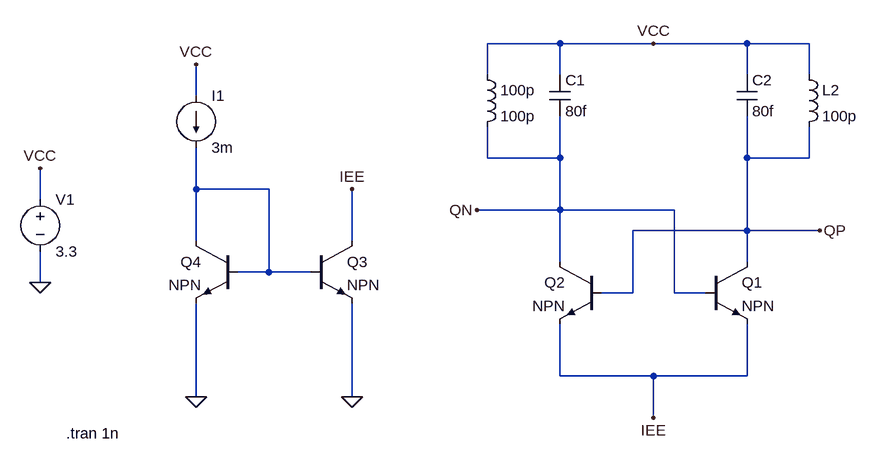
[diagram p0: schematic vco.asc]
vco.asc, the LTspice schematic file:
Version 4
SHEET 1 880 872
WIRE 240 -32 128 -32
WIRE 384 -32 240 -32
WIRE 528 -32 384 -32
WIRE 624 -32 528 -32
WIRE 128 16 128 -32
WIRE 240 16 240 -32
WIRE 528 16 528 -32
WIRE 624 16 624 -32
WIRE -320 48 -320 0
WIRE 128 144 128 96
WIRE 240 144 240 80
WIRE 240 144 128 144
WIRE 528 144 528 80
WIRE 624 144 624 96
WIRE 624 144 528 144
WIRE -320 192 -320 128
WIRE -208 192 -320 192
WIRE -560 208 -560 160
WIRE 240 224 240 144
WIRE 240 224 112 224
WIRE 416 224 240 224
WIRE 528 256 528 144
WIRE 528 256 352 256
WIRE 640 256 528 256
WIRE -320 272 -320 192
WIRE -80 272 -80 192
WIRE 240 304 240 224
WIRE 528 304 528 256
WIRE -208 320 -208 192
WIRE -208 320 -256 320
WIRE -144 320 -208 320
WIRE -560 336 -560 288
WIRE 352 352 352 256
WIRE 352 352 304 352
WIRE 416 352 416 224
WIRE 464 352 416 352
WIRE 240 480 240 400
WIRE 384 480 240 480
WIRE 528 480 528 400
WIRE 528 480 384 480
WIRE -320 512 -320 368
WIRE -80 512 -80 368
WIRE 384 544 384 480
FLAG -320 512 0
FLAG -80 512 0
FLAG 112 224 QN
FLAG 640 256 QP
FLAG -560 336 0
FLAG -560 160 VCC
FLAG -320 0 VCC
FLAG 384 -32 VCC
FLAG -80 192 IEE
FLAG 384 544 IEE
SYMBOL ind 112 0 R0
SYMATTR InstName 100p
SYMATTR Value 100p
SYMBOL ind 608 0 R0
SYMATTR InstName L2
SYMATTR Value 100p
SYMBOL cap 224 16 R0
SYMATTR InstName C1
SYMATTR Value 80f
SYMBOL cap 512 16 R0
SYMATTR InstName C2
SYMATTR Value 80f
SYMBOL npn 464 304 R0
SYMATTR InstName Q1
SYMBOL npn 304 304 M0
SYMATTR InstName Q2
SYMBOL npn -144 272 R0
SYMATTR InstName Q3
SYMBOL npn -256 272 M0
SYMATTR InstName Q4
SYMBOL voltage -560 192 R0
WINDOW 123 0 0 Left 0
WINDOW 39 0 0 Left 0
SYMATTR InstName V1
SYMATTR Value 3.3
SYMBOL current -320 48 R0
WINDOW 123 0 0 Left 0
WINDOW 39 0 0 Left 0
SYMATTR InstName I1
SYMATTR Value 3m
TEXT -520 568 Left 2 !.tran 1n

The netlist it stands for:
* vco.asc
L§100p VCC QN 100p
L2 VCC QP 100p
C1 VCC QN 80f
C2 VCC QP 80f
Q1 QP QN IEE 0 NPN
Q2 QN QP IEE 0 NPN
Q3 IEE N001 0 0 NPN
Q4 N001 N001 0 0 NPN
V1 VCC 0 3.3
I1 VCC N001 3m
.model NPN NPN
.model PNP PNP
.lib standard.bjt
.tran 1n
.backanno
.end